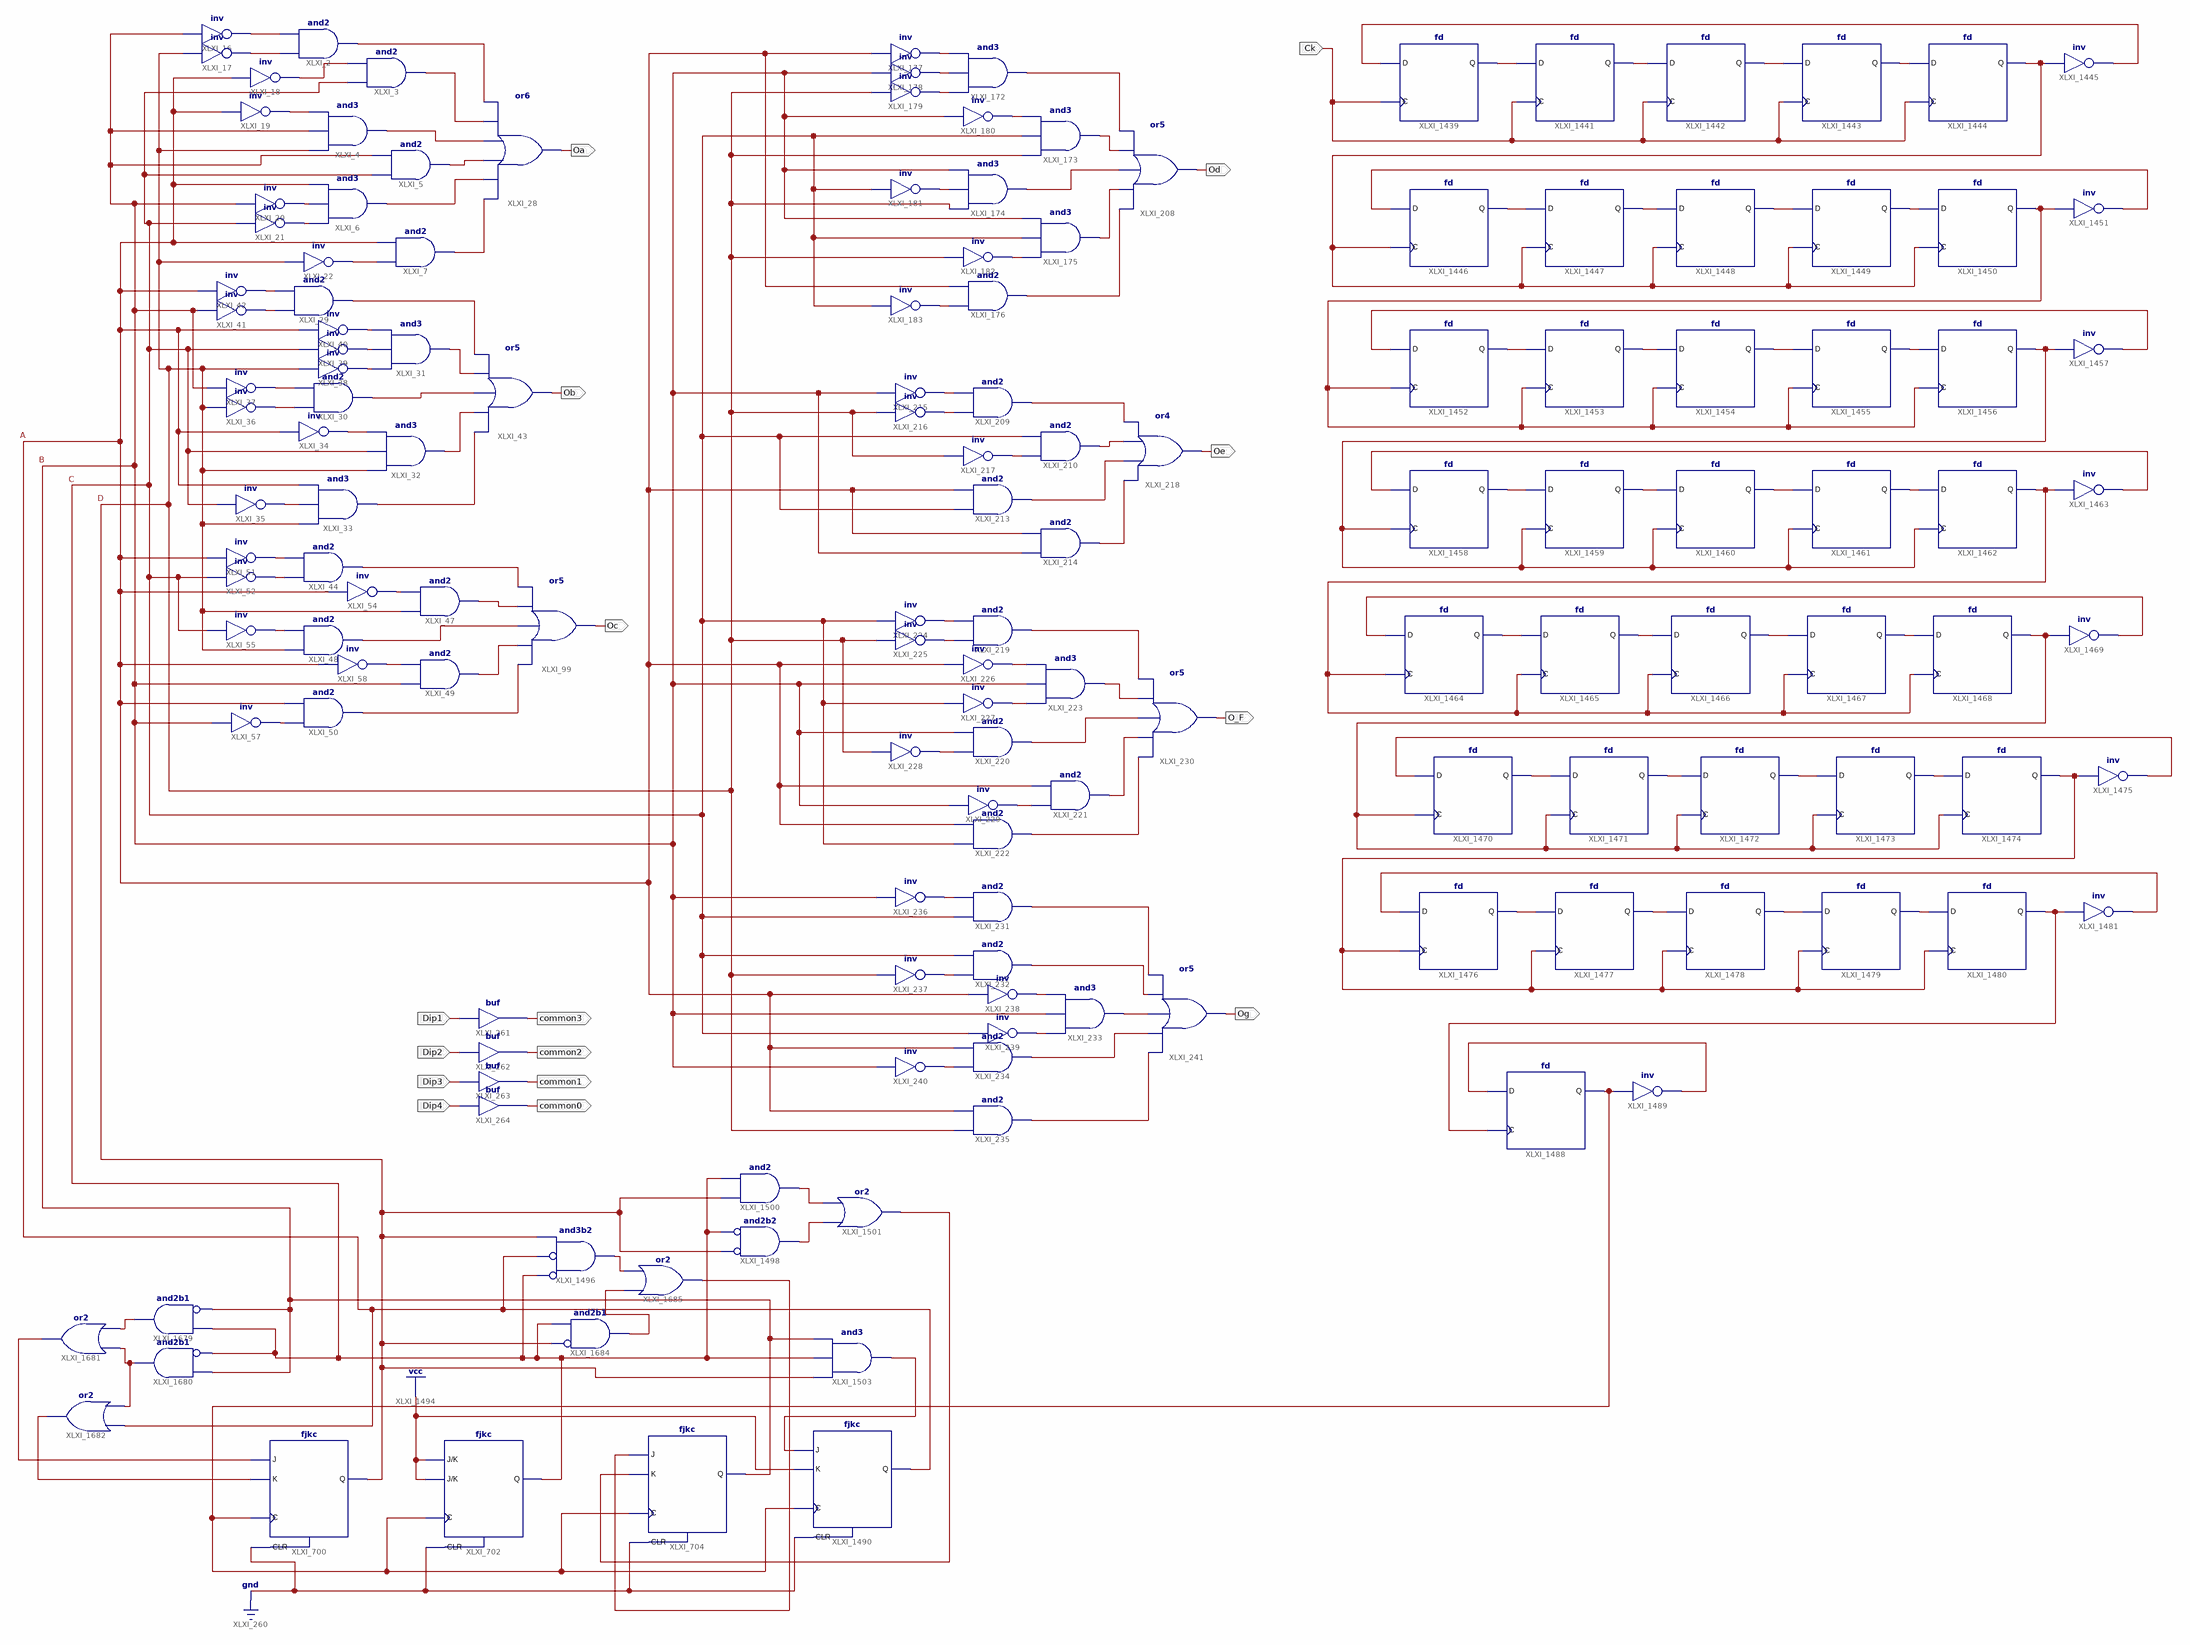
[diagram p0: schematic sheet 1]
// Xilinx ISE schematic Lab8two.sch (spartan6) as structural Verilog: 148 symbols, 16 ports
module Lab8two (
  input  Ck,
  input  Dip1,
  input  Dip2,
  input  Dip3,
  input  Dip4,
  output common3,
  output common2,
  output common1,
  output common0,
  output Oa,
  output Ob,
  output Oc,
  output Od,
  output Oe,
  output O_F,
  output Og
);

  wire A, B, C, D, XLXN_5, XLXN_6, XLXN_7, XLXN_8, XLXN_9, XLXN_10, XLXN_11, XLXN_22, XLXN_23, XLXN_24,
       XLXN_25, XLXN_26, XLXN_27, XLXN_28, XLXN_29, XLXN_33, XLXN_34, XLXN_35, XLXN_36, XLXN_37, XLXN_38,
       XLXN_39, XLXN_46, XLXN_47, XLXN_48, XLXN_49, XLXN_50, XLXN_52, XLXN_53, XLXN_54, XLXN_55, XLXN_56,
       XLXN_57, XLXN_113, XLXN_115, XLXN_116, XLXN_117, XLXN_118, XLXN_215, XLXN_216, XLXN_217, XLXN_218,
       XLXN_219, XLXN_220, XLXN_221, XLXN_249, XLXN_250, XLXN_251, XLXN_252, XLXN_253, XLXN_255, XLXN_256,
       XLXN_257, XLXN_263, XLXN_264, XLXN_265, XLXN_266, XLXN_268, XLXN_269, XLXN_270, XLXN_271, XLXN_272,
       XLXN_273, XLXN_279, XLXN_280, XLXN_281, XLXN_282, XLXN_283, XLXN_285, XLXN_286, XLXN_287, XLXN_288,
       XLXN_289, XLXN_300, XLXN_301, XLXN_302, XLXN_303, XLXN_304, XLXN_2007, XLXN_2008, XLXN_2009,
       XLXN_2010, XLXN_2013, XLXN_2014, XLXN_2015, XLXN_2016, XLXN_2017, XLXN_2018, XLXN_2020, XLXN_2022,
       XLXN_2023, XLXN_2024, XLXN_2025, XLXN_2027, XLXN_2028, XLXN_2029, XLXN_2030, XLXN_2031, XLXN_2032,
       XLXN_2034, XLXN_2035, XLXN_2036, XLXN_2037, XLXN_2038, XLXN_2039, XLXN_2041, XLXN_2042, XLXN_2043,
       XLXN_2044, XLXN_2045, XLXN_2046, XLXN_2048, XLXN_2049, XLXN_2050, XLXN_2051, XLXN_2052, XLXN_2053,
       XLXN_2055, XLXN_2056, XLXN_2063, XLXN_2066, XLXN_2067, XLXN_2094, XLXN_2095, XLXN_2096, XLXN_2098,
       XLXN_2307, XLXN_2308, XLXN_2309, XLXN_2310, XLXN_2312, XLXN_2313, XLXN_2314;

  fjkc XLXI_700 (.C(XLXN_2067), .CLR(1'b0), .J(XLXN_2309), .K(XLXN_2310), .Q(D));
  fjkc XLXI_702 (.C(XLXN_2067), .CLR(1'b0), .J(1'b1), .K(1'b1), .Q(C));
  fjkc XLXI_704 (.C(XLXN_2067), .CLR(1'b0), .J(XLXN_2314), .K(XLXN_2096), .Q(B));
  fd XLXI_1439 (.C(Ck), .D(XLXN_2013), .Q(XLXN_2007));
  fd XLXI_1441 (.C(Ck), .D(XLXN_2007), .Q(XLXN_2008));
  fd XLXI_1442 (.C(Ck), .D(XLXN_2008), .Q(XLXN_2009));
  fd XLXI_1443 (.C(Ck), .D(XLXN_2009), .Q(XLXN_2010));
  fd XLXI_1444 (.C(Ck), .D(XLXN_2010), .Q(XLXN_2014));
  not XLXI_1445 (XLXN_2013, XLXN_2014);
  fd XLXI_1446 (.C(XLXN_2014), .D(XLXN_2020), .Q(XLXN_2015));
  fd XLXI_1447 (.C(XLXN_2014), .D(XLXN_2015), .Q(XLXN_2016));
  fd XLXI_1448 (.C(XLXN_2014), .D(XLXN_2016), .Q(XLXN_2017));
  fd XLXI_1449 (.C(XLXN_2014), .D(XLXN_2017), .Q(XLXN_2018));
  fd XLXI_1450 (.C(XLXN_2014), .D(XLXN_2018), .Q(XLXN_2056));
  not XLXI_1451 (XLXN_2020, XLXN_2056);
  fd XLXI_1452 (.C(XLXN_2056), .D(XLXN_2027), .Q(XLXN_2022));
  fd XLXI_1453 (.C(XLXN_2056), .D(XLXN_2022), .Q(XLXN_2023));
  fd XLXI_1454 (.C(XLXN_2056), .D(XLXN_2023), .Q(XLXN_2024));
  fd XLXI_1455 (.C(XLXN_2056), .D(XLXN_2024), .Q(XLXN_2025));
  fd XLXI_1456 (.C(XLXN_2056), .D(XLXN_2025), .Q(XLXN_2028));
  not XLXI_1457 (XLXN_2027, XLXN_2028);
  fd XLXI_1458 (.C(XLXN_2028), .D(XLXN_2034), .Q(XLXN_2029));
  fd XLXI_1459 (.C(XLXN_2028), .D(XLXN_2029), .Q(XLXN_2030));
  fd XLXI_1460 (.C(XLXN_2028), .D(XLXN_2030), .Q(XLXN_2031));
  fd XLXI_1461 (.C(XLXN_2028), .D(XLXN_2031), .Q(XLXN_2032));
  fd XLXI_1462 (.C(XLXN_2028), .D(XLXN_2032), .Q(XLXN_2035));
  not XLXI_1463 (XLXN_2034, XLXN_2035);
  fd XLXI_1464 (.C(XLXN_2035), .D(XLXN_2041), .Q(XLXN_2036));
  fd XLXI_1465 (.C(XLXN_2035), .D(XLXN_2036), .Q(XLXN_2037));
  fd XLXI_1466 (.C(XLXN_2035), .D(XLXN_2037), .Q(XLXN_2038));
  fd XLXI_1467 (.C(XLXN_2035), .D(XLXN_2038), .Q(XLXN_2039));
  fd XLXI_1468 (.C(XLXN_2035), .D(XLXN_2039), .Q(XLXN_2042));
  not XLXI_1469 (XLXN_2041, XLXN_2042);
  fd XLXI_1470 (.C(XLXN_2042), .D(XLXN_2048), .Q(XLXN_2043));
  fd XLXI_1471 (.C(XLXN_2042), .D(XLXN_2043), .Q(XLXN_2044));
  fd XLXI_1472 (.C(XLXN_2042), .D(XLXN_2044), .Q(XLXN_2045));
  fd XLXI_1473 (.C(XLXN_2042), .D(XLXN_2045), .Q(XLXN_2046));
  fd XLXI_1474 (.C(XLXN_2042), .D(XLXN_2046), .Q(XLXN_2049));
  not XLXI_1475 (XLXN_2048, XLXN_2049);
  fd XLXI_1476 (.C(XLXN_2049), .D(XLXN_2055), .Q(XLXN_2050));
  fd XLXI_1477 (.C(XLXN_2049), .D(XLXN_2050), .Q(XLXN_2051));
  fd XLXI_1478 (.C(XLXN_2049), .D(XLXN_2051), .Q(XLXN_2052));
  fd XLXI_1479 (.C(XLXN_2049), .D(XLXN_2052), .Q(XLXN_2053));
  fd XLXI_1480 (.C(XLXN_2049), .D(XLXN_2053), .Q(XLXN_2063));
  not XLXI_1481 (XLXN_2055, XLXN_2063);
  fd XLXI_1488 (.C(XLXN_2063), .D(XLXN_2066), .Q(XLXN_2067));
  not XLXI_1489 (XLXN_2066, XLXN_2067);
  and XLXI_1496 (XLXN_2312, ~C, ~A, D);  // and3b2
  and XLXI_1498 (XLXN_2095, ~D, ~C);  // and2b2
  and XLXI_1500 (XLXN_2094, D, C);
  or XLXI_1501 (XLXN_2096, XLXN_2095, XLXN_2094);
  fjkc XLXI_1490 (.C(XLXN_2067), .CLR(1'b0), .J(XLXN_2098), .K(1'b1), .Q(A));
  and XLXI_1503 (XLXN_2098, D, C, B);
  buf XLXI_261 (common3, Dip1);
  buf XLXI_262 (common2, Dip2);
  buf XLXI_263 (common1, Dip3);
  buf XLXI_264 (common0, Dip4);
  and XLXI_2 (XLXN_22, XLXN_6, XLXN_5);
  and XLXI_3 (XLXN_23, C, XLXN_7);
  not XLXI_16 (XLXN_5, B);
  not XLXI_17 (XLXN_6, D);
  not XLXI_18 (XLXN_7, A);
  and XLXI_4 (XLXN_24, D, B, XLXN_8);
  and XLXI_5 (XLXN_25, C, B);
  and XLXI_6 (XLXN_26, XLXN_10, XLXN_9, A);
  not XLXI_19 (XLXN_8, A);
  not XLXI_21 (XLXN_10, C);
  not XLXI_20 (XLXN_9, B);
  and XLXI_7 (XLXN_27, XLXN_11, A);
  not XLXI_22 (XLXN_11, D);
  or XLXI_28 (Oa, XLXN_27, XLXN_26, XLXN_25, XLXN_24, XLXN_23, XLXN_22);
  and XLXI_30 (XLXN_48, XLXN_34, XLXN_35);
  and XLXI_31 (XLXN_47, XLXN_36, XLXN_37, XLXN_38);
  and XLXI_32 (XLXN_49, D, C, XLXN_33);
  and XLXI_33 (XLXN_50, D, XLXN_39, A);
  not XLXI_34 (XLXN_33, A);
  not XLXI_35 (XLXN_39, C);
  not XLXI_36 (XLXN_34, D);
  not XLXI_37 (XLXN_35, B);
  not XLXI_38 (XLXN_36, D);
  not XLXI_39 (XLXN_37, C);
  and XLXI_29 (XLXN_46, XLXN_29, XLXN_28);
  not XLXI_40 (XLXN_38, A);
  not XLXI_41 (XLXN_29, B);
  not XLXI_42 (XLXN_28, A);
  or XLXI_43 (Ob, XLXN_50, XLXN_49, XLXN_48, XLXN_47, XLXN_46);
  or XLXI_99 (Oc, XLXN_118, XLXN_117, XLXN_116, XLXN_115, XLXN_113);
  not XLXI_58 (XLXN_56, A);
  not XLXI_57 (XLXN_57, B);
  not XLXI_55 (XLXN_55, C);
  not XLXI_54 (XLXN_54, A);
  and XLXI_49 (XLXN_117, B, XLXN_56);
  and XLXI_47 (XLXN_115, D, XLXN_54);
  not XLXI_52 (XLXN_53, C);
  not XLXI_51 (XLXN_52, A);
  and XLXI_50 (XLXN_118, XLXN_57, A);
  and XLXI_48 (XLXN_116, D, XLXN_55);
  and XLXI_44 (XLXN_113, XLXN_53, XLXN_52);
  and XLXI_172 (XLXN_249, XLXN_219, XLXN_220, XLXN_221);
  and XLXI_173 (XLXN_250, D, C, XLXN_218);
  and XLXI_174 (XLXN_251, D, XLXN_217, B);
  and XLXI_175 (XLXN_252, XLXN_216, C, B);
  and XLXI_176 (XLXN_253, XLXN_215, A);
  not XLXI_177 (XLXN_221, A);
  not XLXI_178 (XLXN_220, B);
  not XLXI_179 (XLXN_219, D);
  not XLXI_180 (XLXN_218, B);
  not XLXI_181 (XLXN_217, C);
  not XLXI_182 (XLXN_216, D);
  not XLXI_183 (XLXN_215, C);
  or XLXI_208 (Od, XLXN_253, XLXN_252, XLXN_251, XLXN_250, XLXN_249);
  and XLXI_209 (XLXN_263, XLXN_256, XLXN_255);
  and XLXI_210 (XLXN_264, XLXN_257, C);
  and XLXI_213 (XLXN_265, C, A);
  and XLXI_214 (XLXN_266, B, A);
  not XLXI_215 (XLXN_255, B);
  not XLXI_216 (XLXN_256, D);
  not XLXI_217 (XLXN_257, D);
  or XLXI_218 (Oe, XLXN_266, XLXN_265, XLXN_264, XLXN_263);
  and XLXI_219 (XLXN_279, XLXN_269, XLXN_268);
  and XLXI_220 (XLXN_281, XLXN_272, B);
  and XLXI_221 (XLXN_282, XLXN_273, A);
  and XLXI_222 (XLXN_283, C, A);
  and XLXI_223 (XLXN_280, XLXN_271, B, XLXN_270);
  not XLXI_224 (XLXN_268, C);
  not XLXI_225 (XLXN_269, D);
  not XLXI_226 (XLXN_270, A);
  not XLXI_227 (XLXN_271, C);
  not XLXI_228 (XLXN_272, D);
  not XLXI_229 (XLXN_273, B);
  or XLXI_230 (O_F, XLXN_283, XLXN_282, XLXN_281, XLXN_280, XLXN_279);
  and XLXI_231 (XLXN_301, C, XLXN_289);
  and XLXI_232 (XLXN_302, XLXN_288, C);
  and XLXI_233 (XLXN_300, XLXN_286, B, XLXN_285);
  and XLXI_234 (XLXN_303, XLXN_287, A);
  and XLXI_235 (XLXN_304, D, A);
  not XLXI_236 (XLXN_289, B);
  not XLXI_237 (XLXN_288, D);
  not XLXI_238 (XLXN_285, A);
  not XLXI_239 (XLXN_286, C);
  not XLXI_240 (XLXN_287, B);
  or XLXI_241 (Og, XLXN_304, XLXN_303, XLXN_300, XLXN_302, XLXN_301);
  and XLXI_1679 (XLXN_2307, ~B, C);  // and2b1
  and XLXI_1680 (XLXN_2308, ~C, B);  // and2b1
  or XLXI_1681 (XLXN_2309, XLXN_2307, XLXN_2308);
  or XLXI_1682 (XLXN_2310, XLXN_2308, A);
  and XLXI_1684 (XLXN_2313, ~D, C);  // and2b1
  or XLXI_1685 (XLXN_2314, XLXN_2313, XLXN_2312);
endmodule
